# EAGLE design M117B (EAGLE 6.6.0)
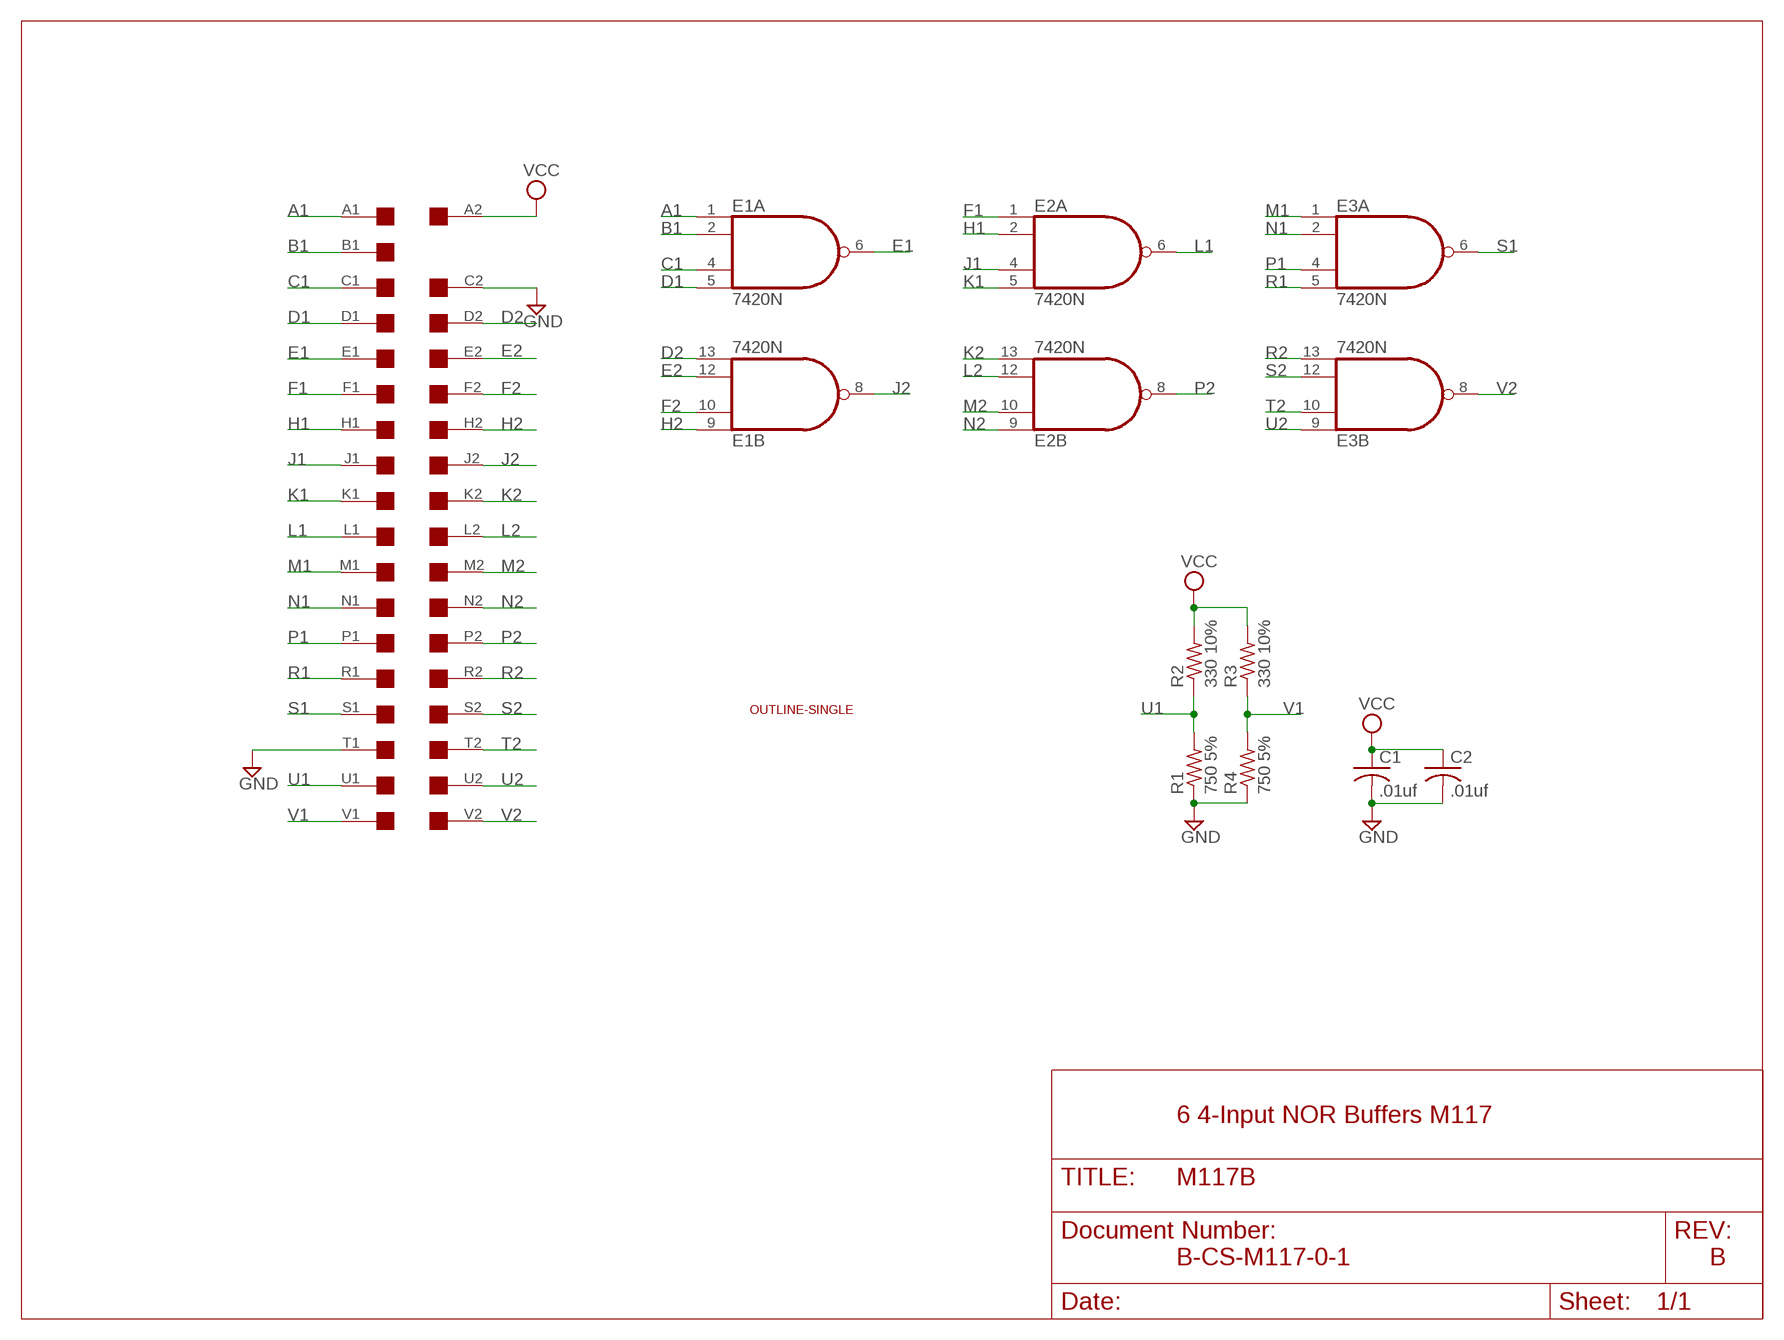
[diagram p0: schematic, sheet 1]

## Parts
C1  .01uf  C-US075-032X103  [C075-032X103]
C2  .01uf  C-US075-032X103  [C075-032X103]
E1  7420N  74S20N  [DIL14]
E2  7420N  74S20N  [DIL14]
E3  7420N  74S20N  [DIL14]
R1  750 5%  R-US_0207/15  [0207/15]
R2  330 10%  R-US_0207/15  [0207/15]
R3  330 10%  R-US_0207/15  [0207/15]
R4  750 5%  R-US_0207/15  [0207/15]
U$1  SINGLE  [EDGE-CON2]
U$4  OUTLINE-SINGLE  [SINGLE]

## Nets
A1: E1.1(A:I0) U$1.A1
B1: E1.2(A:I1) U$1.B1
C1: E1.4(A:I2) U$1.C1
D1: E1.5(A:I3) U$1.D1
D2: E1.13(B:I3) U$1.D2
E1: E1.6(A:O) U$1.E1
E2: E1.12(B:I2) U$1.E2
F1: E2.1(A:I0) U$1.F1
F2: E1.10(B:I1) U$1.F2
GND [Supply]: C1.2 C2.2 R1.1 R4.1 U$1.C2 U$1.T1
H1: E2.2(A:I1) U$1.H1
H2: E1.9(B:I0) U$1.H2
J1: E2.4(A:I2) U$1.J1
J2: E1.8(B:O) U$1.J2
K1: E2.5(A:I3) U$1.K1
K2: E2.13(B:I3) U$1.K2
L1: E2.6(A:O) U$1.L1
L2: E2.12(B:I2) U$1.L2
M1: E3.1(A:I0) U$1.M1
M2: E2.10(B:I1) U$1.M2
N1: E3.2(A:I1) U$1.N1
N2: E2.9(B:I0) U$1.N2
P1: E3.4(A:I2) U$1.P1
P2: E2.8(B:O) U$1.P2
R1: E3.5(A:I3) U$1.R1
R2: E3.13(B:I3) U$1.R2
S1: E3.6(A:O) U$1.S1
S2: E3.12(B:I2) U$1.S2
T2: E3.10(B:I1) U$1.T2
U1: R1.2 R2.1 U$1.U1
U2: E3.9(B:I0) U$1.U2
V1: R3.1 R4.2 U$1.V1
V2: E3.8(B:O) U$1.V2
VCC [Supply]: C1.1 C2.1 R2.2 R3.2 U$1.A2
Unconnected: U$1.B2

## Notes on the sheet
- 6 4-Input NOR Buffers M117
- B-CS-M117-0-1 | B

## Power pins joined to a net without a drawn wire
GND: E1.7(P:GND) E2.7(P:GND) E3.7(P:GND)
VCC: E1.14(P:VCC) E2.14(P:VCC) E3.14(P:VCC)

## Library data of the parts
C1 C2 = rcl:C-US: CAPACITOR, American symbol
E1-E3 = 74xx-us:74*20: Dual 4-input NAND gate
R1-R4 = rcl:R-US_: RESISTOR, American symbol
U$1 = dec-con:SINGLE: Single-Height DEC board
U$4 = dec-con:OUTLINE-*: Board outlines for DEC boards.

## Net classes
1 Supply: width 0.813 mm

## Board
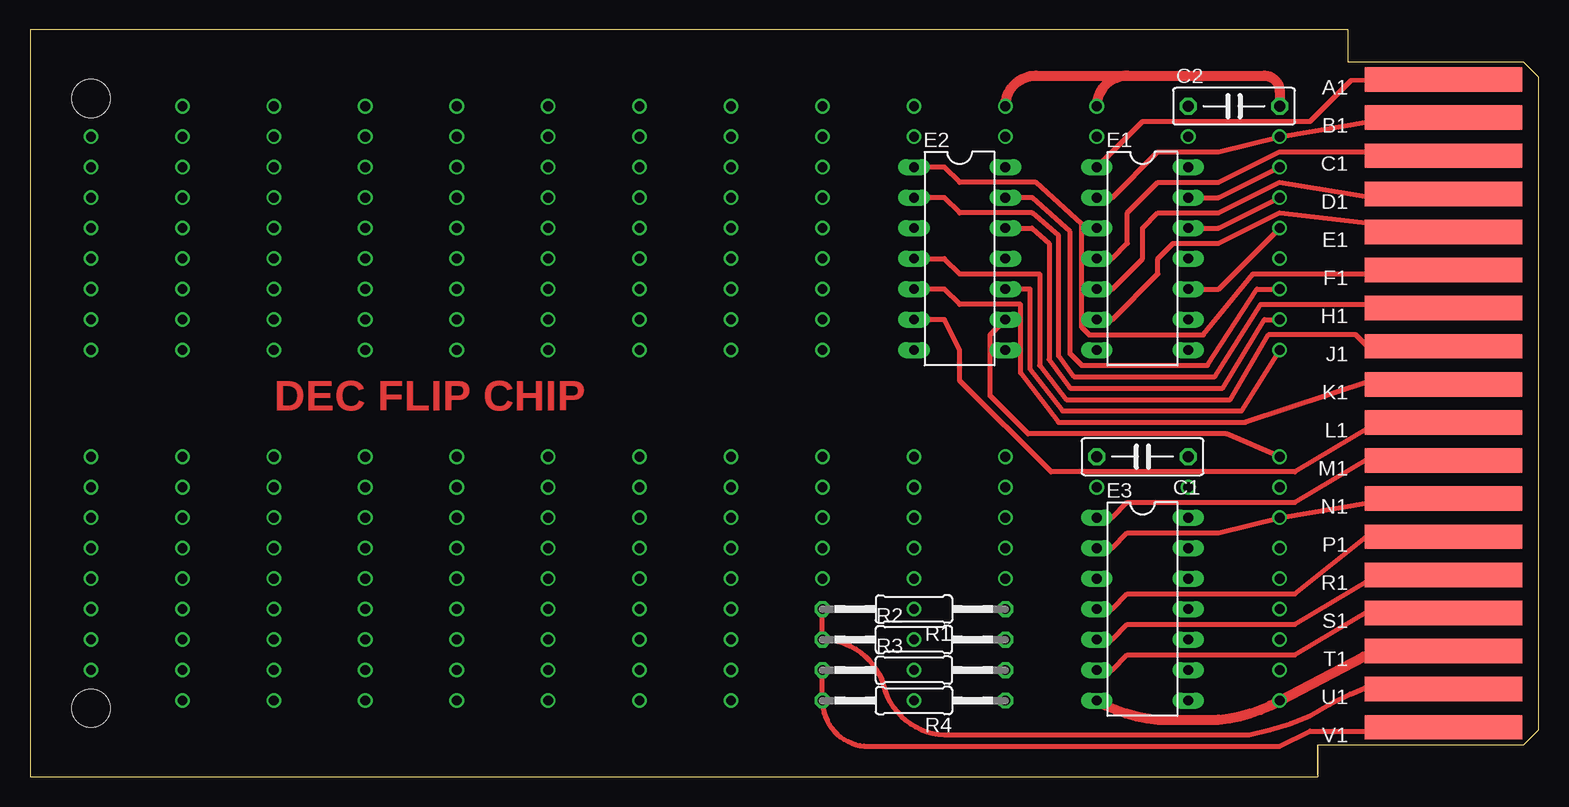
[diagram p1: board, top side]
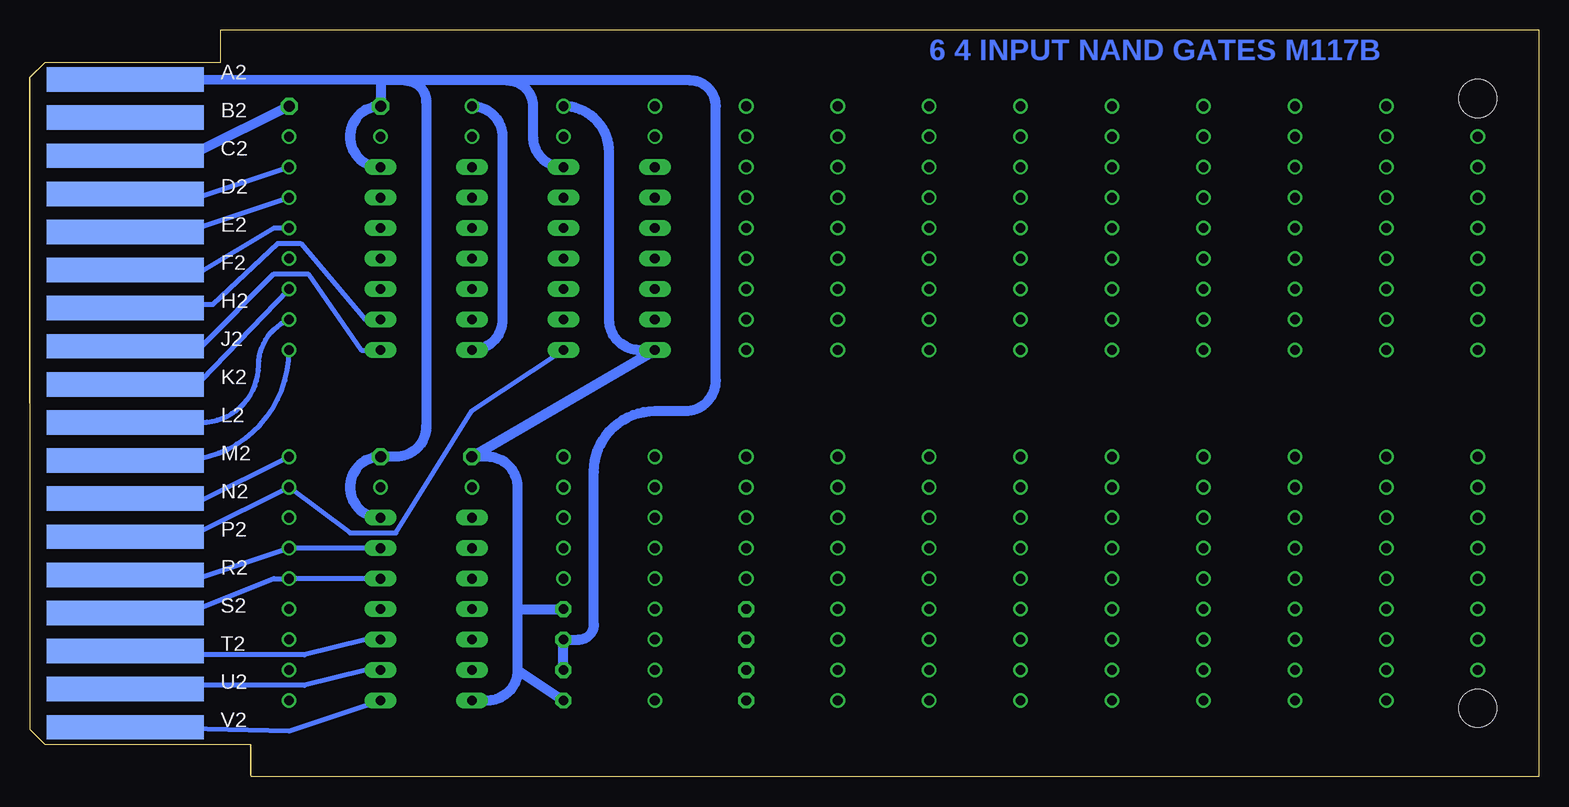
[diagram p2: board, bottom side, seen from below]

Size 125.73 x 62.23 mm. Coordinates in mm from the lower left corner, seen from the top.
Copper layers (1+16): Top 0.035mm / dielectric 1.5mm / Bottom 0.035mm
Design rules "16mils": minimum track width 16mil, minimum drill 32mil, track to track 15mil, track to pad 10mil, pad to pad 10mil, via to via 10mil, smd to smd 10mil, copper to edge 13mil, drill to drill 10mil, minimum pad ring 10mil, minimum via ring 8mil, stop-mask expansion 0mil, vias tented up to drill 0mil, thermal gap 10mil

### Footprints (pad centres in the part's own frame; a part is rotated, then mirrored left to right if it is on the bottom)
C075-032X103 = drill 0.914 octagon: 1 -3.81,0; 2 3.81,0
DIL14 = drill 0.813 long: 1 -7.62,-3.81; 2 -5.08,-3.81; 3 -2.54,-3.81; 4 0,-3.81; 5 2.54,-3.81; 6 5.08,-3.81; 7 7.62,-3.81; 8 7.62,3.81; 9 5.08,3.81; 10 2.54,3.81; 11 0,3.81; 12 -2.54,3.81; 13 -5.08,3.81; 14 -7.62,3.81
0207/15 = drill 0.813 octagon: 1 -7.62,0; 2 7.62,0
EDGE-CON2 = smd 13.106 x 2.032: A1 7.938,4.128; B1 7.938,7.303; C1 7.938,10.477; D1 7.938,13.652; E1 7.938,16.828; F1 7.938,20.003; H1 7.938,23.177; J1 7.938,26.352; K1 7.938,29.527; L1 7.938,32.703; M1 7.938,35.877; N1 7.938,39.053; P1 7.938,42.227; R1 7.938,45.403; S1 7.938,48.578; T1 7.938,51.752; U1 7.938,54.928; V1 7.938,58.102 | smd 13.106 x 2.032 bottom: A2 7.938,4.128; B2 7.938,7.303; C2 7.938,10.477; D2 7.938,13.652; E2 7.938,16.828; F2 7.938,20.003; H2 7.938,23.177; J2 7.938,26.352; K2 7.938,29.527; L2 7.938,32.703; M2 7.938,35.877; N2 7.938,39.053; P2 7.938,42.227; R2 7.938,45.403; S2 7.938,48.578; T2 7.938,51.752; U2 7.938,54.928; V2 7.938,58.102
SINGLE = hole 3.175: 120.65,56.515; 120.65,5.715

### Placement (x,y rotation side)
C1  92.71,26.67 180 top
C2  100.33,55.88 0 top
E1  92.71,43.18 270 top
E2  77.47,43.18 270 top
E3  92.71,13.97 270 top
R1  73.66,13.97 180 top
R2  73.66,11.43 0 top
R3  73.66,8.89 0 top
R4  73.66,6.35 180 top
U$1  125.73,62.23 180 top
U$4  125.73,62.23 180 top

### Tracks (layer width: path | path; a pad name or v marks a point on that pad's centre or on a via)
A1
  Top 0.406: U$1.A1 110.09,58.02 106.68,54.61 92.71,54.61 E1.1
B1  (via drill 0.81)
  Top 0.406: U$1.B1 112.05,54.9 111.76,54.61 v104.14,53.34 99.06,52.07 93.98,52.07 90.17,48.26 E1.2
C1
  Top 0.406: U$1.C1 117.77,52.07 104.14,52.07 99.06,49.53 93.98,49.53 91.44,46.99 91.44,44.45 90.17,43.18 E1.4
D1
  Top 0.406: U$1.D1 112.05,48.26 104.14,49.53 99.06,46.99 93.98,46.99 92.71,45.72 92.71,43.18 90.17,40.64 E1.5
D2  (via drill 0.81)
  Top 0.406: E1.13 99.06,48.26 v104.14,50.8
  Bottom 0.406: U$1.D2 111.76,48.26 v104.14,50.8
E1
  Top 0.406: U$1.E1 104.14,46.99 99.06,44.45 95.25,44.45 93.98,43.18 93.98,41.91 90.17,38.1 E1.6
E2  (via drill 0.81)
  Top 0.406: E1.12 99.06,45.72 v104.14,48.26
  Bottom 0.406: U$1.E2 111.76,45.72 v104.14,48.26
F1
  Top 0.406: U$1.F1 111.76,41.91 101.92,41.91 97.79,36.83 88.27,36.83 87.63,37.47 87.63,46.04 83.82,49.53 77.47,49.53 76.2,50.8 E2.1
F2  (via drill 0.81)
  Top 0.406: E1.10 99.06,40.64 v104.14,45.72
  Bottom 0.406: U$1.F2 111.76,41.91 105.41,45.72 v104.14,45.72
GND  (via drill 0.81)
  Top 0.813: C2.2 104.14,57.15 arc90 102.87,58.42 91.44,58.42 | 91.44,58.42 arc90 v88.9,55.88 | 91.44,58.42 83.82,58.42 arc90 v81.28,55.88 | U$1.T1 111.12,10 v104.14,6.35 arc-25 99.06,4.76 arc-3 93.98,4.76 arc-25 E3.7
  Bottom 0.813: U$1.C2 112.09,51.74 111.76,52.07 C2.2 | v88.9,55.88 arc90 86.36,53.34 86.36,38.1 arc90 E1.7 | v81.28,55.88 arc90 77.47,52.07 77.47,38.1 arc-90 74.93,35.56 E2.7 C1.2 87.63,26.67 arc90 85.09,24.13 85.09,13.97 | 85.09,8.89 85.09,13.97 | E3.7 87.63,6.35 arc-90 85.09,8.89 | 85.09,13.97 R1.1 | R4.1 85.09,8.89
H1
  Top 0.406: E2.2 76.2,48.26 77.47,46.99 83.5,46.99 85.72,45.09 85.72,35.08 87,33.34 98.74,33.34 102.55,39.37 111.76,39.37 U$1.H1
H2
  Bottom 0.406: U$1.H2 111.76,39.37 110.49,39.37 105.09,44.45 103.19,44.45 97.79,38.1 E1.9
J1
  Top 0.406: E2.4 76.2,43.18 77.47,41.91 84.14,41.91 84.14,34.29 86.36,31.43 100.01,31.43 103.19,36.83 110.49,36.83 111.76,35.56 U$1.J1
J2
  Bottom 0.406: U$1.J2 111.43,35.89 105.41,41.91 102.55,41.91 98.11,35.56 E1.8
K1
  Top 0.406: E2.5 76.2,40.64 77.47,39.37 82.55,39.37 82.55,33.66 85.72,29.53 101.28,29.53 111.76,33.02 U$1.K1
K2  (via drill 0.81)
  Top 0.406: E2.13 83.5,48.26 86.68,45.4 86.68,35.24 87.63,34.29 98.11,34.29 102.23,40.64 v104.14,40.64
  Bottom 0.406: U$1.K2 111.44,33.02 v104.14,40.64
L1
  Top 0.406: U$1.L1 111.76,29.21 105.41,25.4 85.09,25.4 77.47,33.02 77.47,35.56 76.2,38.1 E2.6
L2  (via drill 0.81)
  Top 0.406: E2.12 83.5,45.72 84.93,44.45 84.93,34.77 86.68,32.38 99.38,32.38 102.87,38.1 v104.14,38.1
  Bottom 0.406: U$1.L2 111.43,29.54 arc-90 106.68,34.29 arc67 v104.14,38.1
M1
  Top 0.406: U$1.M1 111.76,26.67 105.41,22.86 91.44,22.86 90.17,21.59 E3.1
M2  (via drill 0.81)
  Top 0.406: E2.10 83.34,40.64 83.34,33.97 86.04,30.48 100.97,30.48 v104.14,35.56
  Bottom 0.406: U$1.M2 113.36,26.34 arc-90 v104.14,35.56
N1  (via drill 0.81)
  Top 0.406: U$1.N1 111.76,22.86 v104.14,21.59 99.06,20.32 91.44,20.32 90.17,19.05 E3.2
N2  (via drill 0.81)
  Top 0.406: v104.14,26.67 99.69,28.57 83.19,28.57 80.01,31.75 80.01,36.83 E2.9
  Bottom 0.406: U$1.N2 111.76,22.86 v104.14,26.67
N$1  (via drill 0.81)
  other vias: 5.08,53.34
N$2  (via drill 0.81)
  other vias: 5.08,50.8
N$3  (via drill 0.81)
  other vias: 5.08,48.26
N$4  (via drill 0.81)
  other vias: 5.08,45.72
N$5  (via drill 0.81)
  other vias: 5.08,43.18
N$6  (via drill 0.81)
  other vias: 5.08,40.64
N$7  (via drill 0.81)
  other vias: 5.08,38.1
N$8  (via drill 0.81)
  other vias: 5.08,35.56
N$9  (via drill 0.81)
  other vias: 12.7,35.56
N$10  (via drill 0.81)
  other vias: 12.7,38.1
N$11  (via drill 0.81)
  other vias: 12.7,40.64
N$12  (via drill 0.81)
  other vias: 12.7,43.18
N$13  (via drill 0.81)
  other vias: 12.7,45.72
N$14  (via drill 0.81)
  other vias: 12.7,48.26
N$15  (via drill 0.81)
  other vias: 12.7,50.8
N$16  (via drill 0.81)
  other vias: 12.7,53.34
N$17  (via drill 0.81)
  other vias: 12.7,55.88
N$18  (via drill 0.81)
  other vias: 5.08,8.89
N$19  (via drill 0.81)
  other vias: 5.08,11.43
N$20  (via drill 0.81)
  other vias: 5.08,13.97
N$21  (via drill 0.81)
  other vias: 5.08,16.51
N$22  (via drill 0.81)
  other vias: 5.08,19.05
N$23  (via drill 0.81)
  other vias: 5.08,21.59
N$24  (via drill 0.81)
  other vias: 5.08,24.13
N$25  (via drill 0.81)
  other vias: 5.08,26.67
N$26  (via drill 0.81)
  other vias: 12.7,26.67
N$27  (via drill 0.81)
  other vias: 12.7,24.13
N$28  (via drill 0.81)
  other vias: 12.7,21.59
N$29  (via drill 0.81)
  other vias: 12.7,19.05
N$30  (via drill 0.81)
  other vias: 12.7,16.51
N$31  (via drill 0.81)
  other vias: 12.7,13.97
N$32  (via drill 0.81)
  other vias: 12.7,11.43
N$33  (via drill 0.81)
  other vias: 12.7,8.89
N$34  (via drill 0.81)
  other vias: 12.7,6.35
N$35  (via drill 0.81)
  other vias: 20.32,35.56
N$36  (via drill 0.81)
  other vias: 20.32,38.1
N$37  (via drill 0.81)
  other vias: 20.32,40.64
N$38  (via drill 0.81)
  other vias: 20.32,43.18
N$39  (via drill 0.81)
  other vias: 20.32,45.72
N$40  (via drill 0.81)
  other vias: 20.32,48.26
N$41  (via drill 0.81)
  other vias: 20.32,50.8
N$42  (via drill 0.81)
  other vias: 20.32,53.34
N$43  (via drill 0.81)
  other vias: 20.32,55.88
N$44  (via drill 0.81)
  other vias: 20.32,26.67
N$45  (via drill 0.81)
  other vias: 20.32,24.13
N$46  (via drill 0.81)
  other vias: 20.32,21.59
N$47  (via drill 0.81)
  other vias: 20.32,19.05
N$48  (via drill 0.81)
  other vias: 20.32,16.51
N$49  (via drill 0.81)
  other vias: 20.32,13.97
N$50  (via drill 0.81)
  other vias: 20.32,11.43
N$51  (via drill 0.81)
  other vias: 20.32,8.89
N$52  (via drill 0.81)
  other vias: 20.32,6.35
N$53  (via drill 0.81)
  other vias: 27.94,35.56
N$54  (via drill 0.81)
  other vias: 27.94,38.1
N$55  (via drill 0.81)
  other vias: 27.94,40.64
N$56  (via drill 0.81)
  other vias: 27.94,43.18
N$57  (via drill 0.81)
  other vias: 27.94,45.72
N$58  (via drill 0.81)
  other vias: 27.94,48.26
N$59  (via drill 0.81)
  other vias: 27.94,50.8
N$60  (via drill 0.81)
  other vias: 27.94,53.34
N$61  (via drill 0.81)
  other vias: 27.94,55.88
N$62  (via drill 0.81)
  other vias: 27.94,26.67
N$63  (via drill 0.81)
  other vias: 27.94,24.13
N$64  (via drill 0.81)
  other vias: 27.94,21.59
N$65  (via drill 0.81)
  other vias: 27.94,19.05
N$66  (via drill 0.81)
  other vias: 27.94,16.51
N$67  (via drill 0.81)
  other vias: 27.94,13.97
N$68  (via drill 0.81)
  other vias: 27.94,11.43
N$69  (via drill 0.81)
  other vias: 27.94,8.89
N$70  (via drill 0.81)
  other vias: 27.94,6.35
N$71  (via drill 0.81)
  other vias: 35.56,35.56
N$72  (via drill 0.81)
  other vias: 35.56,38.1
N$73  (via drill 0.81)
  other vias: 35.56,40.64
N$74  (via drill 0.81)
  other vias: 35.56,43.18
N$75  (via drill 0.81)
  other vias: 35.56,45.72
N$76  (via drill 0.81)
  other vias: 35.56,48.26
N$77  (via drill 0.81)
  other vias: 35.56,50.8
N$78  (via drill 0.81)
  other vias: 35.56,53.34
N$79  (via drill 0.81)
  other vias: 35.56,55.88
N$80  (via drill 0.81)
  other vias: 35.56,26.67
N$81  (via drill 0.81)
  other vias: 35.56,24.13
N$82  (via drill 0.81)
  other vias: 35.56,21.59
N$83  (via drill 0.81)
  other vias: 35.56,19.05
N$84  (via drill 0.81)
  other vias: 35.56,16.51
N$85  (via drill 0.81)
  other vias: 35.56,13.97
N$86  (via drill 0.81)
  other vias: 35.56,11.43
N$87  (via drill 0.81)
  other vias: 35.56,8.89
N$88  (via drill 0.81)
  other vias: 35.56,6.35
N$89  (via drill 0.81)
  other vias: 43.18,35.56
N$90  (via drill 0.81)
  other vias: 43.18,38.1
N$91  (via drill 0.81)
  other vias: 43.18,40.64
N$92  (via drill 0.81)
  other vias: 43.18,43.18
N$93  (via drill 0.81)
  other vias: 43.18,45.72
N$94  (via drill 0.81)
  other vias: 43.18,48.26
N$95  (via drill 0.81)
  other vias: 43.18,50.8
N$96  (via drill 0.81)
  other vias: 43.18,53.34
N$97  (via drill 0.81)
  other vias: 43.18,55.88
N$98  (via drill 0.81)
  other vias: 43.18,26.67
N$99  (via drill 0.81)
  other vias: 43.18,24.13
N$100  (via drill 0.81)
  other vias: 43.18,21.59
N$101  (via drill 0.81)
  other vias: 43.18,19.05
N$102  (via drill 0.81)
  other vias: 43.18,16.51
N$103  (via drill 0.81)
  other vias: 43.18,13.97
N$104  (via drill 0.81)
  other vias: 43.18,11.43
N$105  (via drill 0.81)
  other vias: 43.18,8.89
N$106  (via drill 0.81)
  other vias: 43.18,6.35
N$107  (via drill 0.81)
  other vias: 50.8,35.56
N$108  (via drill 0.81)
  other vias: 50.8,38.1
N$109  (via drill 0.81)
  other vias: 50.8,40.64
N$110  (via drill 0.81)
  other vias: 50.8,43.18
N$111  (via drill 0.81)
  other vias: 50.8,45.72
N$112  (via drill 0.81)
  other vias: 50.8,48.26
N$113  (via drill 0.81)
  other vias: 50.8,50.8
N$114  (via drill 0.81)
  other vias: 50.8,53.34
N$115  (via drill 0.81)
  other vias: 50.8,55.88
N$116  (via drill 0.81)
  other vias: 50.8,26.67
N$117  (via drill 0.81)
  other vias: 50.8,24.13
N$118  (via drill 0.81)
  other vias: 50.8,21.59
N$119  (via drill 0.81)
  other vias: 50.8,19.05
N$120  (via drill 0.81)
  other vias: 50.8,16.51
N$121  (via drill 0.81)
  other vias: 50.8,13.97
N$122  (via drill 0.81)
  other vias: 50.8,11.43
N$123  (via drill 0.81)
  other vias: 50.8,8.89
N$124  (via drill 0.81)
  other vias: 50.8,6.35
N$125  (via drill 0.81)
  other vias: 58.42,35.56
N$126  (via drill 0.81)
  other vias: 58.42,38.1
N$127  (via drill 0.81)
  other vias: 58.42,40.64
N$128  (via drill 0.81)
  other vias: 58.42,43.18
N$129  (via drill 0.81)
  other vias: 58.42,45.72
N$130  (via drill 0.81)
  other vias: 58.42,48.26
N$131  (via drill 0.81)
  other vias: 58.42,50.8
N$132  (via drill 0.81)
  other vias: 58.42,53.34
N$133  (via drill 0.81)
  other vias: 58.42,55.88
N$134  (via drill 0.81)
  other vias: 58.42,26.67
N$135  (via drill 0.81)
  other vias: 58.42,24.13
N$136  (via drill 0.81)
  other vias: 58.42,21.59
N$137  (via drill 0.81)
  other vias: 58.42,19.05
N$138  (via drill 0.81)
  other vias: 58.42,16.51
N$139  (via drill 0.81)
  other vias: 58.42,13.97
N$140  (via drill 0.81)
  other vias: 58.42,11.43
N$141  (via drill 0.81)
  other vias: 58.42,8.89
N$142  (via drill 0.81)
  other vias: 58.42,6.35
N$143  (via drill 0.81)
  other vias: 66.04,35.56
N$144  (via drill 0.81)
  other vias: 66.04,38.1
N$145  (via drill 0.81)
  other vias: 66.04,40.64
N$146  (via drill 0.81)
  other vias: 66.04,43.18
N$147  (via drill 0.81)
  other vias: 66.04,45.72
N$148  (via drill 0.81)
  other vias: 66.04,48.26
N$149  (via drill 0.81)
  other vias: 66.04,50.8
N$150  (via drill 0.81)
  other vias: 66.04,53.34
N$151  (via drill 0.81)
  other vias: 66.04,55.88
N$152  (via drill 0.81)
  other vias: 66.04,26.67
N$153  (via drill 0.81)
  other vias: 66.04,24.13
N$154  (via drill 0.81)
  other vias: 66.04,21.59
N$155  (via drill 0.81)
  other vias: 66.04,19.05
N$156  (via drill 0.81)
  other vias: 66.04,16.51
N$168  (via drill 0.81)
  other vias: 73.66,53.34
N$169  (via drill 0.81)
  other vias: 73.66,55.88
N$170  (via drill 0.81)
  other vias: 73.66,26.67
N$171  (via drill 0.81)
  other vias: 73.66,24.13
N$172  (via drill 0.81)
  other vias: 73.66,21.59
N$173  (via drill 0.81)
  other vias: 73.66,19.05
N$174  (via drill 0.81)
  other vias: 73.66,16.51
N$175  (via drill 0.81)
  other vias: 73.66,13.97
N$176  (via drill 0.81)
  other vias: 73.66,11.43
N$177  (via drill 0.81)
  other vias: 73.66,8.89
N$178  (via drill 0.81)
  other vias: 73.66,6.35
N$186  (via drill 0.81)
  other vias: 81.28,53.34
N$188  (via drill 0.81)
  other vias: 81.28,26.67
N$189  (via drill 0.81)
  other vias: 81.28,24.13
N$190  (via drill 0.81)
  other vias: 81.28,21.59
N$191  (via drill 0.81)
  other vias: 81.28,19.05
N$192  (via drill 0.81)
  other vias: 81.28,16.51
N$204  (via drill 0.81)
  other vias: 88.9,53.34
N$207  (via drill 0.81)
  other vias: 88.9,24.13
N$222  (via drill 0.81)
  other vias: 96.52,53.34
N$225  (via drill 0.81)
  other vias: 96.52,24.13
N$236  (via drill 0.81)
  other vias: 104.14,43.18
N$247  (via drill 0.81)
  other vias: 104.14,13.97
N$248  (via drill 0.81)
  other vias: 104.14,11.43
N$249  (via drill 0.81)
  other vias: 104.14,8.89
P1
  Top 0.406: U$1.P1 111.76,20.32 105.41,15.24 91.44,15.24 90.17,13.97 E3.4
P2  (via drill 0.81)
  Bottom 0.406: U$1.P2 111.76,20.32 v104.14,24.13 99.06,20.32 95.25,20.32 88.9,30.48 E2.8
R1
  Top 0.406: U$1.R1 111.76,16.51 105.41,12.7 91.44,12.7 90.17,11.43 E3.5
R2  (via drill 0.81)
  Bottom 0.406: U$1.R2 111.76,16.51 v104.14,19.05 E3.13
S1
  Top 0.406: U$1.S1 111.76,13.97 105.41,10.16 91.44,10.16 90.17,8.89 E3.6
S2  (via drill 0.81)
  Bottom 0.406: U$1.S2 111.76,13.97 105.41,16.51 v104.14,16.51 E3.12
T2
  Bottom 0.406: U$1.T2 111.76,10.16 102.87,10.16 97.79,11.43 E3.10
U1
  Top 0.406: R1.2 R2.1 arc-74 71.12,7.62 arc74 76.2,3.49 101.6,3.49 arc12 106.68,5.08 arc-12 111.76,7.62 U$1.U1
U2
  Bottom 0.406: U$1.U2 111.76,7.62 102.87,7.62 97.79,8.89 E3.9
V1
  Top 0.406: R3.1 R4.2 arc90 69.85,2.54 104.14,2.54 106.68,3.81 111.76,3.81 112.15,4.2 U$1.V1
V2
  Bottom 0.406: U$1.V2 104.14,3.81 E3.8
VCC
  Bottom 0.813: 85.96,58.02 94.49,58.02 | 94.49,58.02 96.52,58.02 | 96.52,58.02 U$1.A2 | 85.96,58.02 arc90 83.82,55.88 83.82,53.34 arc-90 E2.14 | R3.2 R2.2 80.01,11.43 arc-90 78.74,12.7 78.74,25.4 arc90 73.66,30.48 71.12,30.48 arc-90 68.58,33.02 68.58,55.88 arc-90 70.72,58.02 85.96,58.02 | E1.14 arc90 99.06,53.34 arc90 C2.1 96.52,58.02 | E3.14 arc90 99.06,24.13 arc90 C1.1 95.25,26.67 arc-90 92.71,29.21 92.71,56.24 arc-90 94.49,58.02

### Text on the board
Top: DEC FLIP CHIP
Bottom: 6 4 INPUT NAND GATES M117B